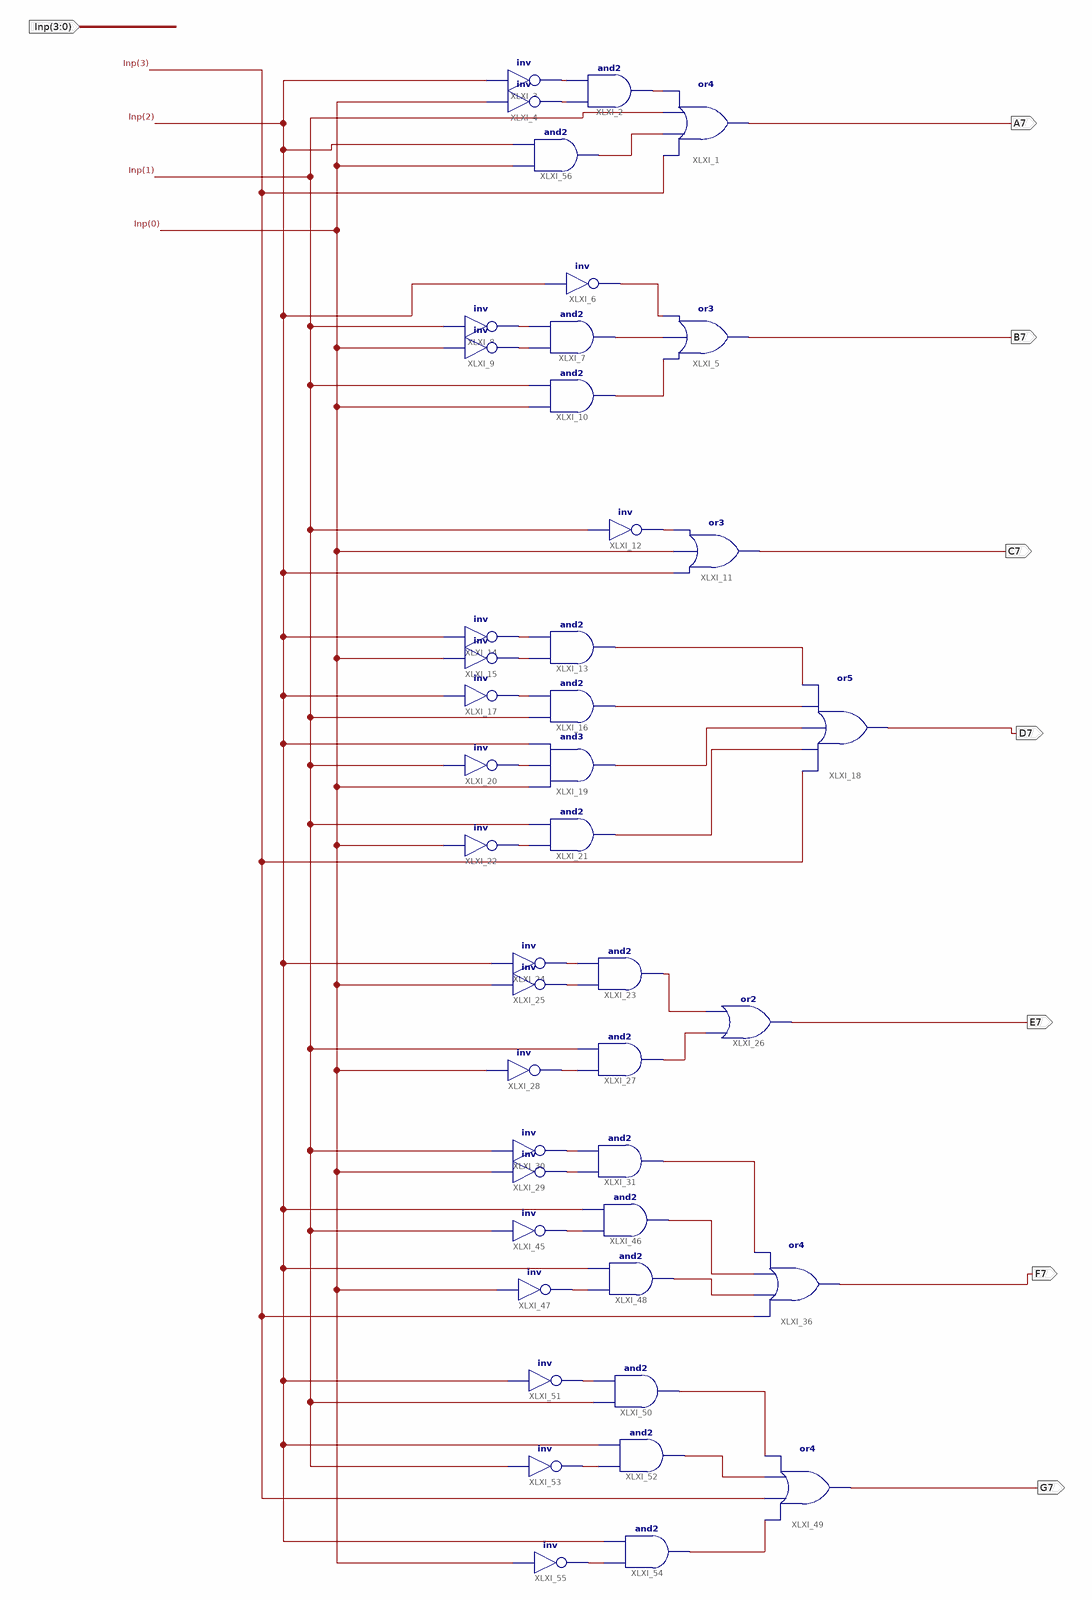
[diagram p0: schematic sheet 1]
// Xilinx ISE schematic betterBCDto7seg.sch (spartan6) as structural Verilog: 44 symbols, 8 ports
module betterBCDto7seg (
  input  [3:0] Inp,
  output A7,
  output B7,
  output C7,
  output D7,
  output E7,
  output F7,
  output G7
);

  wire XLXN_8, XLXN_9, XLXN_10, XLXN_11, XLXN_13, XLXN_14, XLXN_15, XLXN_16, XLXN_17, XLXN_19, XLXN_21,
       XLXN_22, XLXN_23, XLXN_24, XLXN_25, XLXN_26, XLXN_27, XLXN_28, XLXN_29, XLXN_30, XLXN_31, XLXN_33,
       XLXN_34, XLXN_52, XLXN_54, XLXN_55, XLXN_56, XLXN_57, XLXN_58, XLXN_61, XLXN_62, XLXN_64, XLXN_65,
       XLXN_66, XLXN_68, XLXN_69, XLXN_70;

  or XLXI_1 (A7, Inp[3], XLXN_11, Inp[1], XLXN_8);
  and XLXI_2 (XLXN_8, XLXN_10, XLXN_9);
  not XLXI_3 (XLXN_9, Inp[2]);
  not XLXI_4 (XLXN_10, Inp[0]);
  or XLXI_5 (B7, XLXN_17, XLXN_16, XLXN_13);
  not XLXI_6 (XLXN_13, Inp[2]);
  and XLXI_7 (XLXN_16, XLXN_15, XLXN_14);
  not XLXI_8 (XLXN_14, Inp[1]);
  not XLXI_9 (XLXN_15, Inp[0]);
  and XLXI_10 (XLXN_17, Inp[0], Inp[1]);
  or XLXI_11 (C7, Inp[2], Inp[0], XLXN_19);
  not XLXI_12 (XLXN_19, Inp[1]);
  and XLXI_13 (XLXN_23, XLXN_22, XLXN_21);
  not XLXI_14 (XLXN_21, Inp[2]);
  not XLXI_15 (XLXN_22, Inp[0]);
  and XLXI_16 (XLXN_25, Inp[1], XLXN_24);
  not XLXI_17 (XLXN_24, Inp[2]);
  or XLXI_18 (D7, Inp[3], XLXN_28, XLXN_27, XLXN_25, XLXN_23);
  and XLXI_19 (XLXN_27, Inp[0], XLXN_26, Inp[2]);
  not XLXI_20 (XLXN_26, Inp[1]);
  and XLXI_21 (XLXN_28, XLXN_29, Inp[1]);
  not XLXI_22 (XLXN_29, Inp[0]);
  and XLXI_23 (XLXN_33, XLXN_31, XLXN_30);
  not XLXI_24 (XLXN_30, Inp[2]);
  not XLXI_25 (XLXN_31, Inp[0]);
  or XLXI_26 (E7, XLXN_52, XLXN_33);
  and XLXI_27 (XLXN_52, XLXN_34, Inp[1]);
  not XLXI_28 (XLXN_34, Inp[0]);
  not XLXI_29 (XLXN_55, Inp[0]);
  not XLXI_30 (XLXN_54, Inp[1]);
  and XLXI_31 (XLXN_56, XLXN_55, XLXN_54);
  not XLXI_45 (XLXN_57, Inp[1]);
  and XLXI_46 (XLXN_62, XLXN_57, Inp[2]);
  not XLXI_47 (XLXN_58, Inp[0]);
  and XLXI_48 (XLXN_61, XLXN_58, Inp[2]);
  or XLXI_36 (F7, Inp[3], XLXN_61, XLXN_62, XLXN_56);
  or XLXI_49 (G7, XLXN_70, Inp[3], XLXN_69, XLXN_68);
  and XLXI_50 (XLXN_68, Inp[1], XLXN_64);
  not XLXI_51 (XLXN_64, Inp[2]);
  and XLXI_52 (XLXN_69, XLXN_65, Inp[2]);
  not XLXI_53 (XLXN_65, Inp[1]);
  and XLXI_54 (XLXN_70, XLXN_66, Inp[2]);
  not XLXI_55 (XLXN_66, Inp[0]);
  and XLXI_56 (XLXN_11, Inp[0], Inp[2]);
endmodule
